# EAGLE design board (EAGLE 5.10)
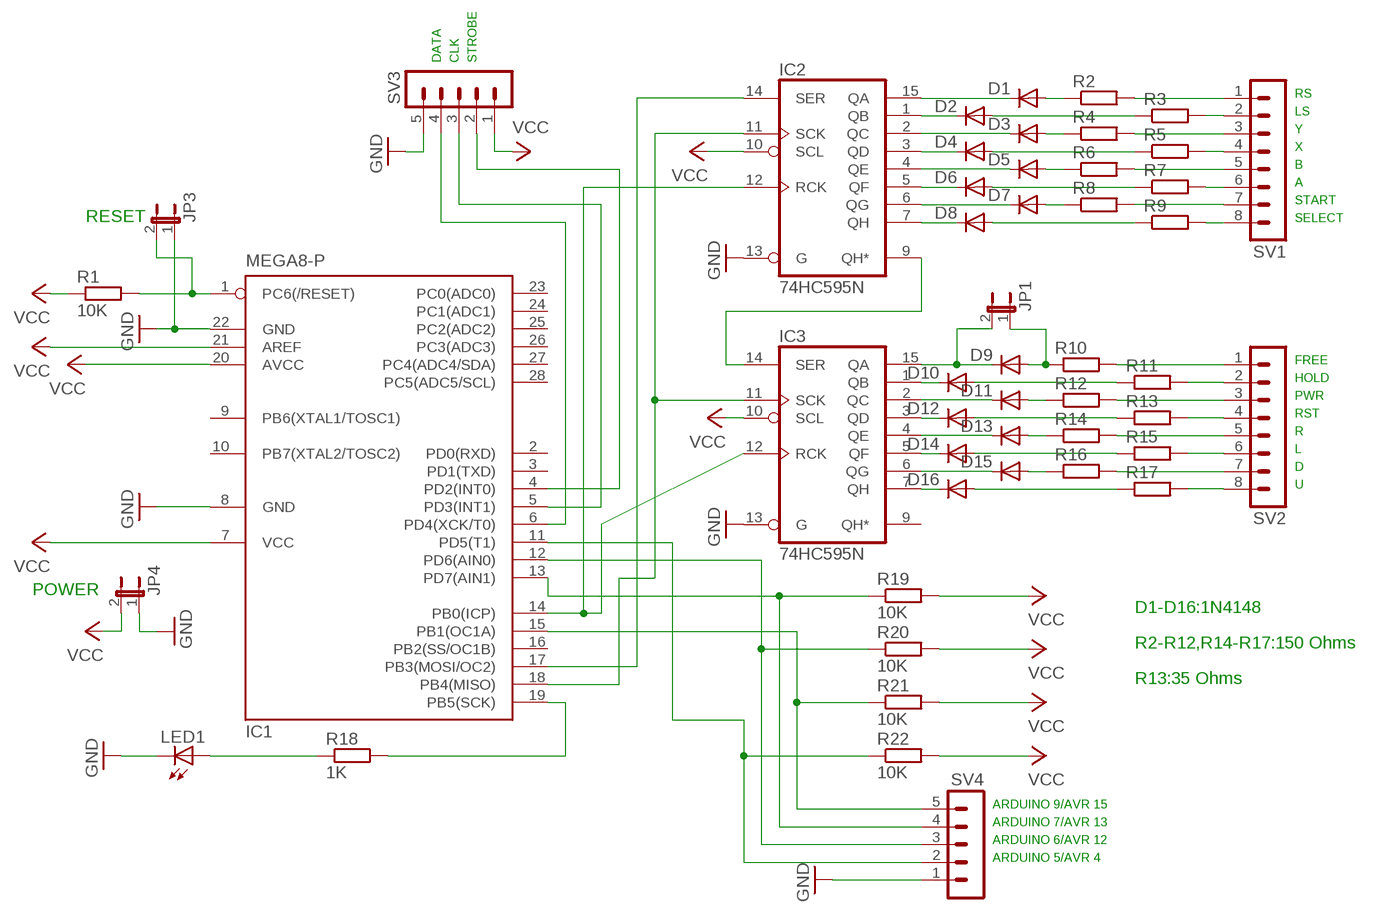
[diagram p0: schematic, sheet 1]

## Parts
D1  1N4148DO35-7  [DO35-7]
D2  1N4148DO35-7  [DO35-7]
D3  1N4148DO35-7  [DO35-7]
D4  1N4148DO35-7  [DO35-7]
D5  1N4148DO35-7  [DO35-7]
D6  1N4148DO35-7  [DO35-7]
D7  1N4148DO35-7  [DO35-7]
D8  1N4148DO35-7  [DO35-7]
D9  1N4148DO35-7  [DO35-7]
D10  1N4148DO35-7  [DO35-7]
D11  1N4148DO35-7  [DO35-7]
D12  1N4148DO35-7  [DO35-7]
D13  1N4148DO35-7  [DO35-7]
D14  1N4148DO35-7  [DO35-7]
D15  1N4148DO35-7  [DO35-7]
D16  1N4148DO35-7  [DO35-7]
IC1  MEGA8-P  [DIL28-3]
IC2  74HC595N  [DIL16]
IC3  74HC595N  [DIL16]
JP1  JP1E  [JP1]
JP3  JP1E  [JP1]
JP4  JP1E  [JP1]
LED1  LED3MM  [LED3MM]
R1  10K  R-EU_0207/2V  [0207/2V]
R2  R-EU_0207/2V  [0207/2V]
R3  R-EU_0207/2V  [0207/2V]
R4  R-EU_0207/2V  [0207/2V]
R5  R-EU_0207/2V  [0207/2V]
R6  R-EU_0207/2V  [0207/2V]
R7  R-EU_0207/2V  [0207/2V]
R8  R-EU_0207/2V  [0207/2V]
R9  R-EU_0207/2V  [0207/2V]
R10  R-EU_0207/2V  [0207/2V]
R11  R-EU_0207/2V  [0207/2V]
R12  R-EU_0207/2V  [0207/2V]
R13  R-EU_0207/2V  [0207/2V]
R14  R-EU_0207/2V  [0207/2V]
R15  R-EU_0207/2V  [0207/2V]
R16  R-EU_0207/2V  [0207/2V]
R17  R-EU_0207/2V  [0207/2V]
R18  1K  R-EU_0207/2V  [0207/2V]
R19  10K  R-EU_0207/2V  [0207/2V]
R20  10K  R-EU_0207/2V  [0207/2V]
R21  10K  R-EU_0207/2V  [0207/2V]
R22  10K  R-EU_0207/2V  [0207/2V]
SV1  MA08-1  [MA08-1]
SV2  MA08-1  [MA08-1]
SV3  MA05-1  [MA05-1]
SV4  MA05-1  [MA05-1]

## Nets
GND: IC1.8(GND) IC1.22(GND) IC2.13(G) IC3.13(G) JP3.1 JP4.1 LED1.K(C) SV3.5 SV4.1
N$1: IC1.1(PC6(/RESET)) JP3.2 R1.2
N$2: IC1.17(PB3(MOSI/OC2)) IC2.14(SER)
N$3: IC1.18(PB4(MISO)) IC2.11(SCK) IC3.11(SCK)
N$4: IC1.14(PB0(ICP)) IC2.12(RCK) IC3.12(RCK)
N$5: IC2.9(QH*) IC3.14(SER)
N$6: D1.C IC2.15(QA)
N$7: D2.C IC2.1(QB)
N$8: D3.C IC2.2(QC)
N$9: D4.C IC2.3(QD)
N$10: D5.C IC2.4(QE)
N$11: D6.C IC2.5(QF)
N$12: D7.C IC2.6(QG)
N$13: D1.A R2.1
N$14: D9.C IC3.15(QA) JP1.2
N$15: D10.C IC3.1(QB)
N$16: D11.C IC3.2(QC)
N$17: D12.C IC3.3(QD)
N$18: D13.C IC3.4(QE)
N$19: D14.C IC3.5(QF)
N$20: D15.C IC3.6(QG)
N$21: D16.C IC3.7(QH)
N$22: D2.A R3.1
N$23: D4.A R5.1
N$24: D6.A R7.1
N$25: D8.A R9.1
N$26: D8.C IC2.7(QH)
N$27: D3.A R4.1
N$28: D5.A R6.1
N$29: D7.A R8.1
N$31: D11.A R12.1
N$32: D13.A R14.1
N$33: D15.A R16.1
N$34: D16.A R17.1
N$35: D10.A R11.1
N$36: D12.A R13.1
N$37: D14.A R15.1
N$38: R2.2 SV1.1
N$39: R3.2 SV1.2
N$40: R4.2 SV1.3
N$41: R5.2 SV1.4
N$42: R6.2 SV1.5
N$43: R7.2 SV1.6
N$44: R8.2 SV1.7
N$45: R9.2 SV1.8
N$46: R10.2 SV2.1
N$47: R11.2 SV2.2
N$48: R12.2 SV2.3
N$49: R13.2 SV2.4
N$50: R14.2 SV2.5
N$51: R15.2 SV2.6
N$52: R16.2 SV2.7
N$53: R17.2 SV2.8
N$54: IC1.6(PD4(XCK/T0)) SV3.4
N$55: IC1.4(PD2(INT0)) SV3.2
N$56: IC1.19(PB5(SCK)) R18.2
N$57: IC1.5(PD3(INT1)) SV3.3
N$58: LED1.A R18.1
N$59: D9.A JP1.1 R10.1
N$60: IC1.11(PD5(T1)) R22.1 SV4.2
N$61: IC1.12(PD6(AIN0)) R20.1 SV4.3
N$62: IC1.13(PD7(AIN1)) R19.1 SV4.4
N$63: IC1.15(PB1(OC1A)) R21.1 SV4.5
VCC: IC1.7(VCC) IC1.20(AVCC) IC1.21(AREF) IC2.10(SCL) IC3.10(SCL) JP4.2 R1.1 R19.2 R20.2 R21.2 R22.2 SV3.1
Unconnected: IC1.2(PD0(RXD)) IC1.3(PD1(TXD)) IC1.9(PB6(XTAL1/TOSC1)) IC1.10(PB7(XTAL2/TOSC2)) IC1.16(PB2(SS/OC1B)) IC1.23(PC0(ADC0)) IC1.24(PC1(ADC1)) IC1.25(PC2(ADC2)) IC1.26(PC3(ADC3)) IC1.27(PC4(ADC4/SDA)) IC1.28(PC5(ADC5/SCL)) IC3.9(QH*)

## Notes on the sheet
- DATA | CLK | STROBE
- RS
- LS
- Y
- X
- B
- A
- START
- RESET | SELECT
- FREE
- HOLD
- PWR
- RST
- R
- L
- D
- U
- POWER
- D1-D16:1N4148
- R2-R12,R14-R17:150 Ohms
- R13:35 Ohms
- ARDUINO 9/AVR 15
- ARDUINO 7/AVR 13
- ARDUINO 6/AVR 12
- ARDUINO 5/AVR 4

## Power pins joined to a net without a drawn wire
GND: IC2.8(GND) IC3.8(GND)
VCC: IC2.16(VCC) IC3.16(VCC)

## Library data of the parts
D1-D16 = diode:1N4148: DIODE high speed (Philips)
IC1 = atmel:MEGA8-P: MICROCONTROLLER 8 Kbytes FLASH, 1 kbytes SRAM, 512 bytes EEPROM, USART, 4-channel 10 bit ADC, 2-channel 8 bit ADC Pin compatible with Atmega48, ATMega88, ATMega168 Source: avr.lbr
IC2 IC3 = 74xx-eu:74*595: 8-bit SHIFT REGISTER, output latch
JP1 JP3 JP4 = jumper:JP1E: JUMPER
LED1 = led:LED: LED OSRAM: - CHIPLED LG R971, LG N971, LY N971, LG Q971, LY Q971, LO R971, LY R971 LH N974, LH R974 LS Q976, LO Q976, LY Q976 LO Q996 - Hyper CHIPLED LW Q18S LB Q993, LB Q99A, LB R99A - SideLED LS A670, LO A670, LY A670, LG A670, LP A670 LB A673, LV A673, LT A673, LW A673 LH A674 LY A675 LS A676, LA A676, LO A676, LY A676, LW A676 LS A679, LY A679, LG A679 - Hyper Micro SIDELED® LS Y876, LA Y876, LO Y876, LY Y876 LT Y87S - SmartLED LW L88C, LW L88S LB L89C, LB L89S, LG L890 LS L89K, LO L89K, LY L89K LS L896, LA L896, LO L896, LY L896 - TOPLED LS T670, LO T670, LY T670, LG T670, LP T670 LSG T670, LSP T670, LSY T670, LOP T670, LYG T670 LG T671, LOG T671, LSG T671 LB T673, LV T673, LT T673, LW T673 LH T674 LS T676, LA T676, LO T676, LY T676, LB T676, LH T676, LSB T676, LW T676 LB T67C, LV T67C, LT T67C, LS T67K, LO T67K, LY T67K, LW E67C LS E67B, LA E67B, LO E67B, LY E67B, LB E67C, LV E67C, LT E67C LW T67C LS T679, LY T679, LG T679 LS T770, LO T770, LY T770, LG T770, LP T770 LB T773, LV T773, LT T773, LW T773 LH T774 LS E675, LA E675, LY E675, LS T675 LS T776, LA T776, LO T776, LY T776, LB T776 LHGB T686 LT T68C, LB T68C - Hyper Mini TOPLED® LB M676 - Mini TOPLED Santana® LG M470 LS M47K, LO M47K, LY M47K Source: http://www.osram.convergy.de LUXEON: - LUMILED® LXK2-PW12-R00, LXK2-PW12-S00, LXK2-PW14-U00, LXK2-PW14-V00 LXK2-PM12-R00, LXK2-PM12-S00, LXK2-PM14-U00 LXK2-PE12-Q00, LXK2-PE12-R00, LXK2-PE12-S00, LXK2-PE14-T00, LXK2-PE14-U00 LXK2-PB12-K00, LXK2-PB12-L00, LXK2-PB12-M00, LXK2-PB14-N00, LXK2-PB14-P00, LXK2-PB14-Q00 LXK2-PR12-L00, LXK2-PR12-M00, LXK2-PR14-Q00, LXK2-PR14-R00 LXK2-PD12-Q00, LXK2-PD12-R00, LXK2-PD12-S00 LXK2-PH12-R00, LXK2-PH12-S00 LXK2-PL12-P00, LXK2-PL12-Q00, LXK2-PL12-R00 Source: www.luxeon.com KINGBRIGHT: KA-3528ASYC Source: www.kingbright.com
R1-R22 = resistor:R-EU_: RESISTOR, European symbol
SV1 SV2 = con-lstb:MA08-1: PIN HEADER
SV3 SV4 = con-lstb:MA05-1: PIN HEADER

## Board
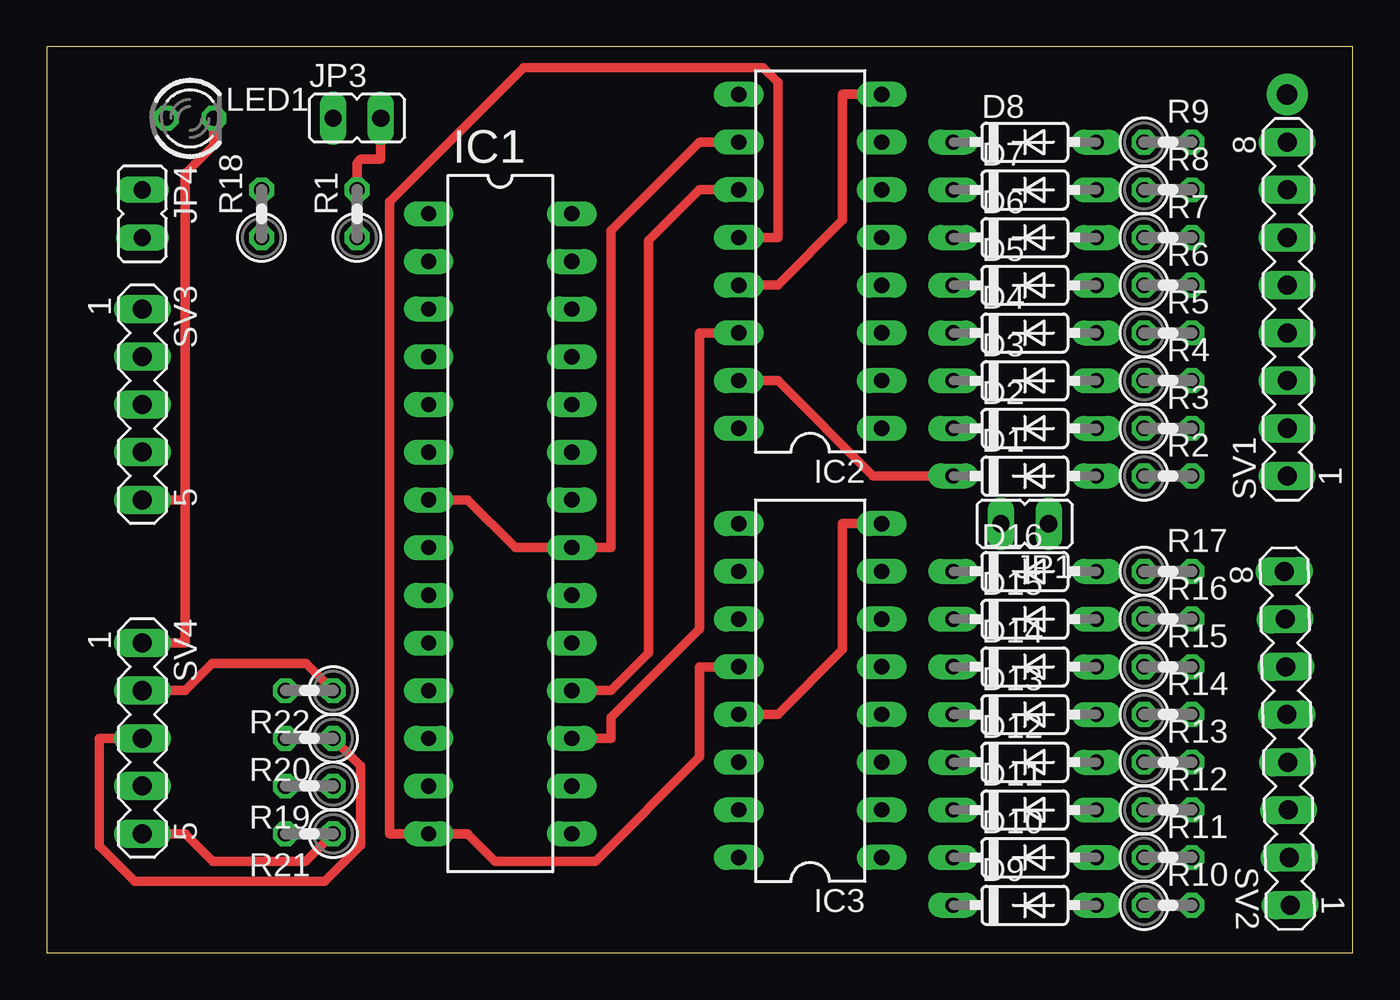
[diagram p1: board, top side]
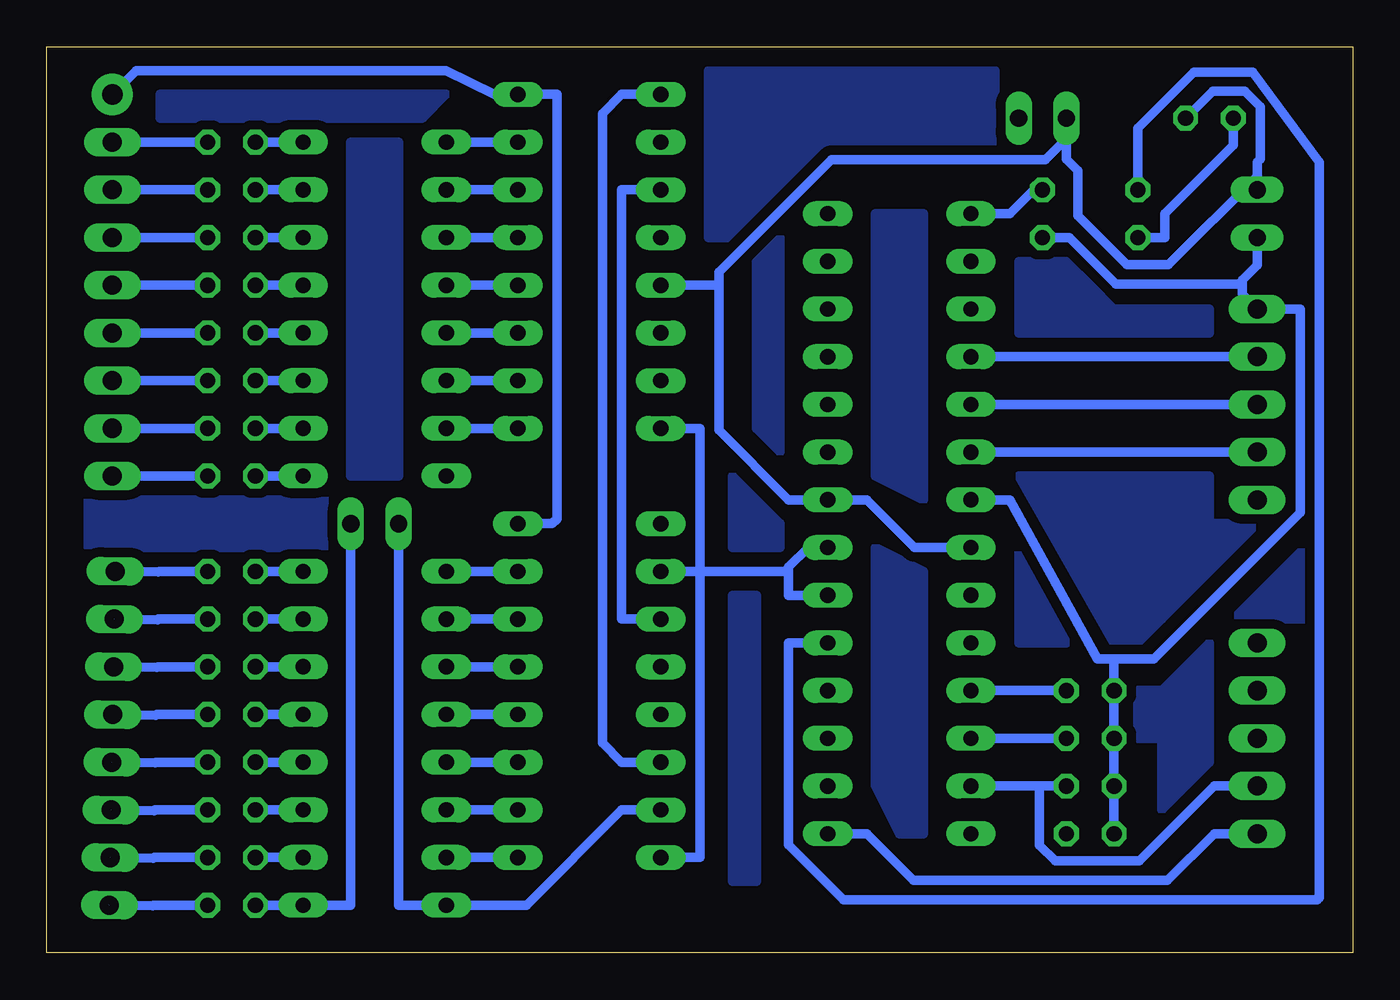
[diagram p2: board, bottom side, seen from below]

Size 69.52 x 48.25 mm. Coordinates in mm from the lower left corner, seen from the top.
Outline: 0,0 69.52,0 69.52,48.25 0,48.25 0,0
Copper layers (1*16): Top 0.035mm / dielectric 1.5mm / Bottom 0.035mm
Design rules "default *": minimum track width 20mil, minimum drill 24mil, track to track 20mil, track to pad 20mil, pad to pad 20mil, via to via 20mil, smd to smd 8mil, copper to edge 40mil, drill to drill 8mil, minimum pad ring 10mil, minimum via ring 8mil, stop-mask expansion 4mil, vias tented up to drill 0mil, thermal gap 10mil

### Footprints (pad centres in the part's own frame; a part is rotated, then mirrored left to right if it is on the bottom)
DO35-7 = drill 0.813 long: A 3.81,0; C -3.81,0
DIL28-3 = drill 0.813 long: 1 -16.51,-3.81; 2 -13.97,-3.81; 3 -11.43,-3.81; 4 -8.89,-3.81; 5 -6.35,-3.81; 6 -3.81,-3.81; 7 -1.27,-3.81; 8 1.27,-3.81; 9 3.81,-3.81; 10 6.35,-3.81; 11 8.89,-3.81; 12 11.43,-3.81; 13 13.97,-3.81; 14 16.51,-3.81; 15 16.51,3.81; 16 13.97,3.81; 17 11.43,3.81; 18 8.89,3.81; 19 6.35,3.81; 20 3.81,3.81; 21 1.27,3.81; 22 -1.27,3.81; 23 -3.81,3.81; 24 -6.35,3.81; 25 -8.89,3.81; 26 -11.43,3.81; 27 -13.97,3.81; 28 -16.51,3.81
DIL16 = drill 0.813 long: 1 -8.89,-3.81; 2 -6.35,-3.81; 3 -3.81,-3.81; 4 -1.27,-3.81; 5 1.27,-3.81; 6 3.81,-3.81; 7 6.35,-3.81; 8 8.89,-3.81; 9 8.89,3.81; 10 6.35,3.81; 11 3.81,3.81; 12 1.27,3.81; 13 -1.27,3.81; 14 -3.81,3.81; 15 -6.35,3.81; 16 -8.89,3.81
JP1 = drill 0.914 long: 1 0,-1.27; 2 0,1.27
LED3MM = drill 0.813 octagon: A -1.27,0; K 1.27,0
0207/2V = drill 0.813 octagon: 1 -1.27,0; 2 1.27,0
MA08-1 = drill 1.016 long: 1 -8.89,0; 2 -6.35,0; 3 -3.81,0; 4 -1.27,0; 5 1.27,0; 6 3.81,0; 7 6.35,0; 8 8.89,0
MA05-1 = drill 1.016 long: 1 -5.08,0; 2 -2.54,0; 3 0,0; 4 2.54,0; 5 5.08,0

### Placement (x,y rotation side)
D1  52.07,25.4 0 top
D2  52.07,27.94 0 top
D3  52.07,30.48 0 top
D4  52.07,33.02 0 top
D5  52.07,35.56 0 top
D6  52.07,38.1 0 top
D7  52.07,40.64 0 top
D8  52.07,43.18 0 top
D9  52.07,2.54 0 top
D10  52.07,5.08 0 top
D11  52.07,7.62 0 top
D12  52.07,10.16 0 top
D13  52.07,12.7 0 top
D14  52.07,15.24 0 top
D15  52.07,17.78 0 top
D16  52.07,20.32 0 top
IC1  24.13,22.86 270 top
IC2  40.64,36.83 90 top
IC3  40.64,13.97 90 top
JP1  52.07,22.86 90 top
JP3  16.51,44.45 270 top
JP4  5.08,39.37 180 top
LED1  7.62,44.45 0 top
R1  16.51,39.37 90 top
R2  59.69,25.4 0 top
R3  59.69,27.94 0 top
R4  59.69,30.48 0 top
R5  59.69,33.02 0 top
R6  59.69,35.56 0 top
R7  59.69,38.1 0 top
R8  59.69,40.64 0 top
R9  59.69,43.18 0 top
R10  59.69,2.54 0 top
R11  59.69,5.08 0 top
R12  59.69,7.62 0 top
R13  59.69,10.16 0 top
R14  59.69,12.7 0 top
R15  59.69,15.24 0 top
R16  59.69,17.78 0 top
R17  59.69,20.32 0 top
R18  11.43,39.37 90 top
R19  13.97,8.89 180 top
R20  13.97,11.43 180 top
R21  13.97,6.35 180 top
R22  13.97,13.97 180 top
SV1  66.04,34.29 90 top
SV2  66.04,11.43 91 top
SV3  5.08,29.21 270 top
SV4  5.08,11.43 270 top

### Tracks (layer width: path | path; a pad name or v marks a point on that pad's centre or on a via)
GND
  Top 0.508: IC3.13 38.91,12.7 42.37,16.15 42.37,22.86 IC3.8 | IC2.8 42.37,45.72 42.37,39.01 38.91,35.56 IC2.13 | LED1.K 8.89,43.03 7.37,41.5 7.37,24.13 | 7.37,24.13 | 7.37,24.13 7.11,24.13 SV3.5 | SV4.1 7.37,16.51 7.37,24.13
  Bottom 0.508: IC3.8 42.62,22.86 42.37,23.11 42.37,45.72 IC2.8 | 33.73,35.56 33.73,27.84 30.02,24.13 IC1.22 25.86,24.13 23.32,21.59 IC1.8 | 15.24,43.36 16.35,42.25 27.75,42.25 33.73,36.27 33.73,35.56 | 33.73,35.56 34.75,35.56 IC2.13 | 15.24,43.36 15.24,42.27 14.63,41.66 14.63,39.27 12.02,36.66 9.8,36.66 5.08,41.38 | 15.24,43.36 JP3.1 | 5.08,41.38 5.08,42.11 4.91,42.28 4.91,45.06 5.74,45.89 7.45,45.89 LED1.K | 5.08,41.38 JP4.1
N$1
  Top 0.508: JP3.2 17.78,42.27 16.71,42.27 16.51,42.06 R1.2
  Bottom 0.508: R1.2 16.97,40.64 18.24,39.37 IC1.1
N$2
  Top 0.508: IC1.17 30.02,11.43 30.02,12.53 34.75,17.26 34.75,33.02 IC2.14
N$3
  Top 0.508: IC1.18 30.02,13.97 32.04,15.99 32.04,37.94 34.75,40.64 IC2.11
  Bottom 0.508: IC2.11 38.91,40.64 38.91,17.78 IC3.11
N$4
  Top 0.508: IC3.12 34.75,15.24 34.75,10.43 29.2,4.89 23.87,4.89 22.4,6.35 IC1.14 18.24,6.35 18.24,40 25.39,47.15 38.12,47.15 38.91,46.36 38.91,38.1 IC2.12
N$5
  Bottom 0.508: IC2.9 38.91,45.72 39.93,44.7 39.93,11.18 38.91,10.16 IC3.14
N$6
  Top 0.508: IC2.15 38.91,30.48 43.99,25.4 D1.C
N$7
  Bottom 0.508: IC2.1 D2.C
N$8
  Bottom 0.508: IC2.2 D3.C
N$9
  Bottom 0.508: IC2.3 D4.C
N$10
  Bottom 0.508: IC2.4 D5.C
N$11
  Bottom 0.508: IC2.5 D6.C
N$12
  Bottom 0.508: IC2.6 D7.C
N$13
  Bottom 0.508: D1.A R2.1
N$14
  Bottom 0.508: IC3.15 38.91,7.62 43.99,2.54 D9.C 50.8,2.54 JP1.2
N$15
  Bottom 0.508: IC3.1 D10.C
N$16
  Bottom 0.508: IC3.2 D11.C
N$17
  Bottom 0.508: IC3.3 D12.C
N$18
  Bottom 0.508: IC3.4 D13.C
N$19
  Bottom 0.508: IC3.5 D14.C
N$20
  Bottom 0.508: IC3.6 D15.C
N$21
  Bottom 0.508: IC3.7 D16.C
N$22
  Bottom 0.508: D2.A R3.1
N$23
  Bottom 0.508: D4.A R5.1
N$24
  Bottom 0.508: D6.A R7.1
N$25
  Bottom 0.508: D8.A R9.1
N$26
  Bottom 0.508: IC2.7 D8.C
N$27
  Bottom 0.508: D3.A R4.1
N$28
  Bottom 0.508: D5.A R6.1
N$29
  Bottom 0.508: D7.A R8.1
N$30  (via drill 1.1 pad 2.18)
  Bottom 0.508: 45.72,45.72 48.26,46.99 64.77,46.99 v66.04,45.72
N$31
  Bottom 0.508: D11.A R12.1
N$32
  Bottom 0.508: D13.A R14.1
N$33
  Bottom 0.508: D15.A R16.1
N$34
  Bottom 0.508: D16.A R17.1
N$35
  Bottom 0.508: D10.A R11.1
N$36
  Bottom 0.508: D12.A R13.1
N$37
  Bottom 0.508: D14.A R15.1
N$38
  Bottom 0.508: R2.2 SV1.1
N$39
  Bottom 0.508: R3.2 SV1.2
N$40
  Bottom 0.508: R4.2 SV1.3
N$41
  Bottom 0.508: R5.2 SV1.4
N$42
  Bottom 0.508: R6.2 SV1.5
N$43
  Bottom 0.508: R7.2 SV1.6
N$44
  Bottom 0.508: R8.2 SV1.7
N$45
  Bottom 0.508: R9.2 SV1.8
N$46  (1 unrouted)
  Bottom 0.508: SV2.1 63.9,2.5 63.86,2.54 R10.2
N$47  (1 unrouted)
  Bottom 0.508: SV2.2 63.85,5.04 63.81,5.08 R11.2
N$48  (1 unrouted)
  Bottom 0.508: SV2.3 63.81,7.58 63.77,7.62 R12.2
N$49  (1 unrouted)
  Bottom 0.508: SV2.4 63.77,10.12 63.73,10.16 R13.2
N$50
  Bottom 0.508: 62.38,12.7 R14.2 | SV2.5 63.72,12.66 63.68,12.7 62.38,12.7 | 62.38,12.7
N$51
  Bottom 0.508: R15.2 62.38,15.24 63.64,15.24 63.68,15.2 SV2.6
N$52  (1 unrouted)
  Bottom 0.508: R16.2 62.38,17.78 63.59,17.78 63.63,17.74 SV2.7
N$53
  Bottom 0.508: SV2.8 63.59,20.28 63.55,20.32 R17.2
N$54
  Bottom 0.508: SV3.4 IC1.6
N$55
  Bottom 0.508: SV3.2 IC1.4
N$56
  Bottom 0.508: IC1.19 30.02,16.51 30.02,5.75 27.11,2.83 1.87,2.83 1.76,2.94 1.76,42.1 5.3,46.91 8.45,46.91 11.43,43.93 R18.2
N$57
  Bottom 0.508: SV3.3 IC1.5
N$58
  Bottom 0.508: R18.1 10.01,38.1 10.01,39.37 6.35,43.03 LED1.A
N$59
  Bottom 0.508: R10.1 D9.A 53.34,2.54 JP1.1
N$60
  Top 0.508: SV4.2 7.37,13.97 8.81,15.41 13.8,15.41 R22.1
  Bottom 0.508: R22.1 18.24,13.97 IC1.11
N$61
  Top 0.508: SV4.3 2.79,11.43 2.79,5.71 4.68,3.82 14.79,3.82 16.69,5.73 16.69,9.98 R20.1
  Bottom 0.508: IC1.12 16.66,11.43 15.86,11.43 R20.1
N$62
  Bottom 0.508: 16.66,8.89 16.66,5.74 15.82,4.9 11.35,4.9 7.37,8.89 SV4.4 | 16.66,8.89 IC1.13 | 16.66,8.89 R19.1
N$63
  Top 0.508: SV4.5 7.37,6.35 8.83,4.88 13.77,4.88 R21.1
  Bottom 0.508: IC1.15 25.86,6.35 23.37,3.86 9.85,3.86 7.37,6.35 SV4.5
N$64
  pour Bottom: 19.05,46.99 19.05,43.18 27.94,43.18 33.02,38.1 34.29,38.1 34.29,46.99
N$65
  pour Bottom: 7.62,25.4 7.62,24.13 7.62,22.86 5.08,22.86 10.16,17.78 11.43,16.51 12.7,16.51 17.78,25.4
N$66
  pour Bottom: 2.54,21.59 2.54,17.78 6.35,17.78
N$67
  pour Bottom: 7.62,16.51 7.62,10.16 10.16,7.62 10.16,11.43 11.43,11.43 11.43,13.97 10.16,13.97
N$68
  pour Bottom: 17.78,21.59 15.24,16.51 17.78,16.51
N$69
  pour Bottom: 22.86,20.32 22.86,6.35 24.13,6.35 25.4,8.89 25.4,21.59
N$70
  pour Bottom: 22.86,39.37 22.86,24.13 25.4,25.4 25.4,39.37
N$71
  pour Bottom: 15.24,36.83 13.97,35.56 12.7,34.29 7.62,34.29 7.62,33.02 17.78,33.02 17.78,36.83
N$72
  pour Bottom: 30.48,38.1 30.48,26.67 31.75,27.94 31.75,29.21 31.75,36.83
N$73
  pour Bottom: 31.75,19.05 31.75,3.81 33.02,3.81 33.02,19.05
N$74
  pour Bottom: 33.02,25.4 30.48,22.86 30.48,21.59 33.02,21.59
N$75
  pour Bottom: 50.8,43.18 50.8,25.4 53.34,25.4 53.34,43.18
N$76
  pour Bottom: 48.26,45.72 49.53,44.45 63.5,44.45 63.5,45.72
N$77
  pour Bottom: 54.61,24.13 54.61,21.59 66.04,21.59 67.31,21.59 67.31,24.13
VCC
  Top 0.508: IC1.7 22.4,24.13 24.94,21.59 IC1.21 30.02,21.59 30.02,38.46 34.75,43.18 IC2.10
  Bottom 0.508: 12.7,15.67 13.59,15.67 18.24,24.13 IC1.7 | 12.7,15.67 10.59,15.67 2.79,23.46 2.79,34.29 SV3.1 5.87,35.08 5.87,35.62 | 12.7,15.67 12.7,15.39 12.7,14.68 R22.2 R20.2 R19.2 R21.2 | 34.75,20.32 34.75,27.94 IC2.16 | 30.02,20.32 34.75,20.32 | IC3.16 34.75,5.08 34.75,20.32 | 30.02,20.32 30.02,19.05 IC1.20 | 30.02,20.32 30.02,20.55 28.98,21.59 IC1.21 | 34.75,20.32 IC3.10 | JP4.2 5.08,36.63 5.87,35.83 5.87,35.62 | 5.87,35.62 12.61,35.62 15.09,38.1 R1.1